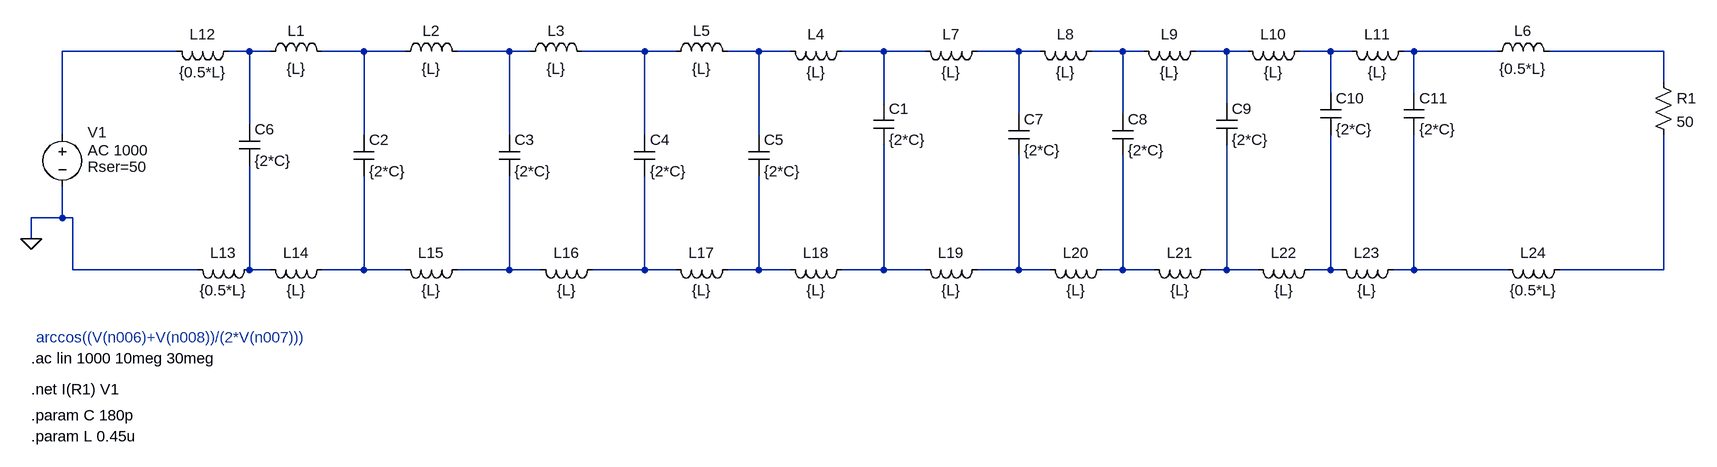
[diagram p0: schematic symmetric_model.asc]
symmetric_model.asc, the LTspice schematic file:
Version 4
SHEET 1 1324 680
WIRE -1440 -176 -1616 -176
WIRE -1328 -176 -1360 -176
WIRE -1296 -176 -1328 -176
WIRE -1152 -176 -1216 -176
WIRE -1088 -176 -1152 -176
WIRE -928 -176 -1008 -176
WIRE -896 -176 -928 -176
WIRE -720 -176 -816 -176
WIRE -672 -176 -720 -176
WIRE -544 -176 -592 -176
WIRE -496 -176 -544 -176
WIRE -352 -176 -416 -176
WIRE -288 -176 -352 -176
WIRE -144 -176 -208 -176
WIRE -112 -176 -144 -176
WIRE 16 -176 -32 -176
WIRE 48 -176 16 -176
WIRE 176 -176 128 -176
WIRE 208 -176 176 -176
WIRE 336 -176 288 -176
WIRE 368 -176 336 -176
WIRE 464 -176 448 -176
WIRE 592 -176 464 -176
WIRE 848 -176 672 -176
WIRE 848 -128 848 -176
WIRE 336 -112 336 -176
WIRE 464 -112 464 -176
WIRE -352 -96 -352 -176
WIRE 176 -96 176 -176
WIRE -144 -80 -144 -176
WIRE 16 -80 16 -176
WIRE -1328 -64 -1328 -176
WIRE -1616 -48 -1616 -176
WIRE -1152 -48 -1152 -176
WIRE -928 -48 -928 -176
WIRE -720 -48 -720 -176
WIRE -544 -48 -544 -176
WIRE -1616 80 -1616 32
WIRE -1616 80 -1664 80
WIRE -1600 80 -1616 80
WIRE -1664 112 -1664 80
WIRE -1600 160 -1600 80
WIRE -1408 160 -1600 160
WIRE -1328 160 -1328 0
WIRE -1296 160 -1328 160
WIRE -1152 160 -1152 16
WIRE -1152 160 -1216 160
WIRE -1088 160 -1152 160
WIRE -928 160 -928 16
WIRE -928 160 -1008 160
WIRE -880 160 -928 160
WIRE -720 160 -720 16
WIRE -720 160 -800 160
WIRE -672 160 -720 160
WIRE -544 160 -544 16
WIRE -544 160 -592 160
WIRE -496 160 -544 160
WIRE -352 160 -352 -32
WIRE -352 160 -416 160
WIRE -288 160 -352 160
WIRE -144 160 -144 -16
WIRE -144 160 -208 160
WIRE -96 160 -144 160
WIRE 16 160 16 -16
WIRE 16 160 -16 160
WIRE 64 160 16 160
WIRE 176 160 176 -32
WIRE 176 160 144 160
WIRE 224 160 176 160
WIRE 336 160 336 -48
WIRE 336 160 304 160
WIRE 352 160 336 160
WIRE 464 160 464 -48
WIRE 464 160 432 160
WIRE 608 160 464 160
WIRE 848 160 848 -48
WIRE 848 160 688 160
FLAG -1664 112 0
SYMBOL voltage -1616 -64 R0
WINDOW 0 39 12 Left 2
WINDOW 123 39 40 Left 2
WINDOW 39 39 65 Left 2
SYMATTR InstName V1
SYMATTR Value2 AC 1000
SYMATTR SpiceLine Rser=50
SYMATTR Value ""
SYMBOL ind -1312 -160 R270
WINDOW 0 32 56 VTop 2
WINDOW 3 5 56 VBottom 2
SYMATTR InstName L1
SYMATTR Value {L}
SYMBOL ind -1104 -160 R270
WINDOW 0 32 56 VTop 2
WINDOW 3 5 56 VBottom 2
SYMATTR InstName L2
SYMATTR Value {L}
SYMBOL ind -912 -160 R270
WINDOW 0 32 56 VTop 2
WINDOW 3 5 56 VBottom 2
SYMATTR InstName L3
SYMATTR Value {L}
SYMBOL ind -688 -160 R270
WINDOW 0 32 56 VTop 2
WINDOW 3 5 56 VBottom 2
SYMATTR InstName L5
SYMATTR Value {L}
SYMBOL ind 576 -160 R270
WINDOW 0 32 56 VTop 2
WINDOW 3 5 56 VBottom 2
SYMATTR InstName L6
SYMATTR Value {0.5*L}
SYMBOL res 832 -144 R0
SYMATTR InstName R1
SYMATTR Value 50
SYMBOL cap -1168 -48 R0
SYMATTR InstName C2
SYMATTR Value {2*C}
SYMBOL cap -944 -48 R0
SYMATTR InstName C3
SYMATTR Value {2*C}
SYMBOL cap -736 -48 R0
SYMATTR InstName C4
SYMATTR Value {2*C}
SYMBOL cap -560 -48 R0
SYMATTR InstName C5
SYMATTR Value {2*C}
SYMBOL cap -368 -96 R0
SYMATTR InstName C1
SYMATTR Value {2*C}
SYMBOL ind -400 -192 R90
WINDOW 0 5 56 VBottom 2
WINDOW 3 32 56 VTop 2
SYMATTR InstName L4
SYMATTR Value {L}
SYMBOL ind -192 -192 R90
WINDOW 0 5 56 VBottom 2
WINDOW 3 32 56 VTop 2
SYMATTR InstName L7
SYMATTR Value {L}
SYMBOL ind -16 -192 R90
WINDOW 0 5 56 VBottom 2
WINDOW 3 32 56 VTop 2
SYMATTR InstName L8
SYMATTR Value {L}
SYMBOL ind 144 -192 R90
WINDOW 0 5 56 VBottom 2
WINDOW 3 32 56 VTop 2
SYMATTR InstName L9
SYMATTR Value {L}
SYMBOL ind 304 -192 R90
WINDOW 0 5 56 VBottom 2
WINDOW 3 32 56 VTop 2
SYMATTR InstName L10
SYMATTR Value {L}
SYMBOL ind 464 -192 R90
WINDOW 0 5 56 VBottom 2
WINDOW 3 32 56 VTop 2
SYMATTR InstName L11
SYMATTR Value {L}
SYMBOL ind -1344 -192 R90
WINDOW 0 5 56 VBottom 2
WINDOW 3 32 56 VTop 2
SYMATTR InstName L12
SYMATTR Value {0.5*L}
SYMBOL cap -1344 -64 R0
SYMATTR InstName C6
SYMATTR Value {2*C}
SYMBOL cap -160 -80 R0
SYMATTR InstName C7
SYMATTR Value {2*C}
SYMBOL cap 0 -80 R0
SYMATTR InstName C8
SYMATTR Value {2*C}
SYMBOL cap 160 -96 R0
SYMATTR InstName C9
SYMATTR Value {2*C}
SYMBOL cap 320 -112 R0
SYMATTR InstName C10
SYMATTR Value {2*C}
SYMBOL cap 448 -112 R0
SYMATTR InstName C11
SYMATTR Value {2*C}
SYMBOL ind -1312 144 R90
WINDOW 0 5 56 VBottom 2
WINDOW 3 32 56 VTop 2
SYMATTR InstName L13
SYMATTR Value {0.5*L}
SYMBOL ind -1200 144 R90
WINDOW 0 5 56 VBottom 2
WINDOW 3 32 56 VTop 2
SYMATTR InstName L14
SYMATTR Value {L}
SYMBOL ind -992 144 R90
WINDOW 0 5 56 VBottom 2
WINDOW 3 32 56 VTop 2
SYMATTR InstName L15
SYMATTR Value {L}
SYMBOL ind -784 144 R90
WINDOW 0 5 56 VBottom 2
WINDOW 3 32 56 VTop 2
SYMATTR InstName L16
SYMATTR Value {L}
SYMBOL ind -576 144 R90
WINDOW 0 5 56 VBottom 2
WINDOW 3 32 56 VTop 2
SYMATTR InstName L17
SYMATTR Value {L}
SYMBOL ind -400 144 R90
WINDOW 0 5 56 VBottom 2
WINDOW 3 32 56 VTop 2
SYMATTR InstName L18
SYMATTR Value {L}
SYMBOL ind -192 144 R90
WINDOW 0 5 56 VBottom 2
WINDOW 3 32 56 VTop 2
SYMATTR InstName L19
SYMATTR Value {L}
SYMBOL ind 0 144 R90
WINDOW 0 5 56 VBottom 2
WINDOW 3 32 56 VTop 2
SYMATTR InstName L20
SYMATTR Value {L}
SYMBOL ind 160 144 R90
WINDOW 0 5 56 VBottom 2
WINDOW 3 32 56 VTop 2
SYMATTR InstName L21
SYMATTR Value {L}
SYMBOL ind 320 144 R90
WINDOW 0 5 56 VBottom 2
WINDOW 3 32 56 VTop 2
SYMATTR InstName L22
SYMATTR Value {L}
SYMBOL ind 448 144 R90
WINDOW 0 5 56 VBottom 2
WINDOW 3 32 56 VTop 2
SYMATTR InstName L23
SYMATTR Value {L}
SYMBOL ind 704 144 R90
WINDOW 0 5 56 VBottom 2
WINDOW 3 32 56 VTop 2
SYMATTR InstName L24
SYMATTR Value {0.5*L}
TEXT -1664 296 Left 2 !.ac lin 1000 10meg 30meg
TEXT -1664 344 Left 2 !.net I(R1) V1
TEXT -1664 384 Left 2 !.param C 180p
TEXT -1664 416 Left 2 !.param L 0.45u
TEXT -1656 264 Left 2 ;arccos((V(n006)+V(n008))/(2*V(n007)))

The netlist it stands for:
* symmetric_model.asc
V1 N001 0 AC 1000 Rser=50
L1 N002 N003 {L}
L2 N003 N004 {L}
L3 N004 N005 {L}
L5 N005 N006 {L}
L6 N012 N013 {0.5*L}
R1 N013 N025 50
C2 N003 N015 {2*C}
C3 N004 N016 {2*C}
C4 N005 N017 {2*C}
C5 N006 N018 {2*C}
C1 N007 N019 {2*C}
L4 N007 N006 {L}
L7 N008 N007 {L}
L8 N009 N008 {L}
L9 N010 N009 {L}
L10 N011 N010 {L}
L11 N012 N011 {L}
L12 N002 N001 {0.5*L}
C6 N002 N014 {2*C}
C7 N008 N020 {2*C}
C8 N009 N021 {2*C}
C9 N010 N022 {2*C}
C10 N011 N023 {2*C}
C11 N012 N024 {2*C}
L13 N014 0 {0.5*L}
L14 N015 N014 {L}
L15 N016 N015 {L}
L16 N017 N016 {L}
L17 N018 N017 {L}
L18 N019 N018 {L}
L19 N020 N019 {L}
L20 N021 N020 {L}
L21 N022 N021 {L}
L22 N023 N022 {L}
L23 N024 N023 {L}
L24 N025 N024 {0.5*L}
.ac lin 1000 10meg 30meg
.net I(R1) V1
.param C 180p
.param L 0.45u
* arccos((V(n006)+V(n008))/(2*V(n007)))
.backanno
.end